# Altium project Tutorial.PrjPcb
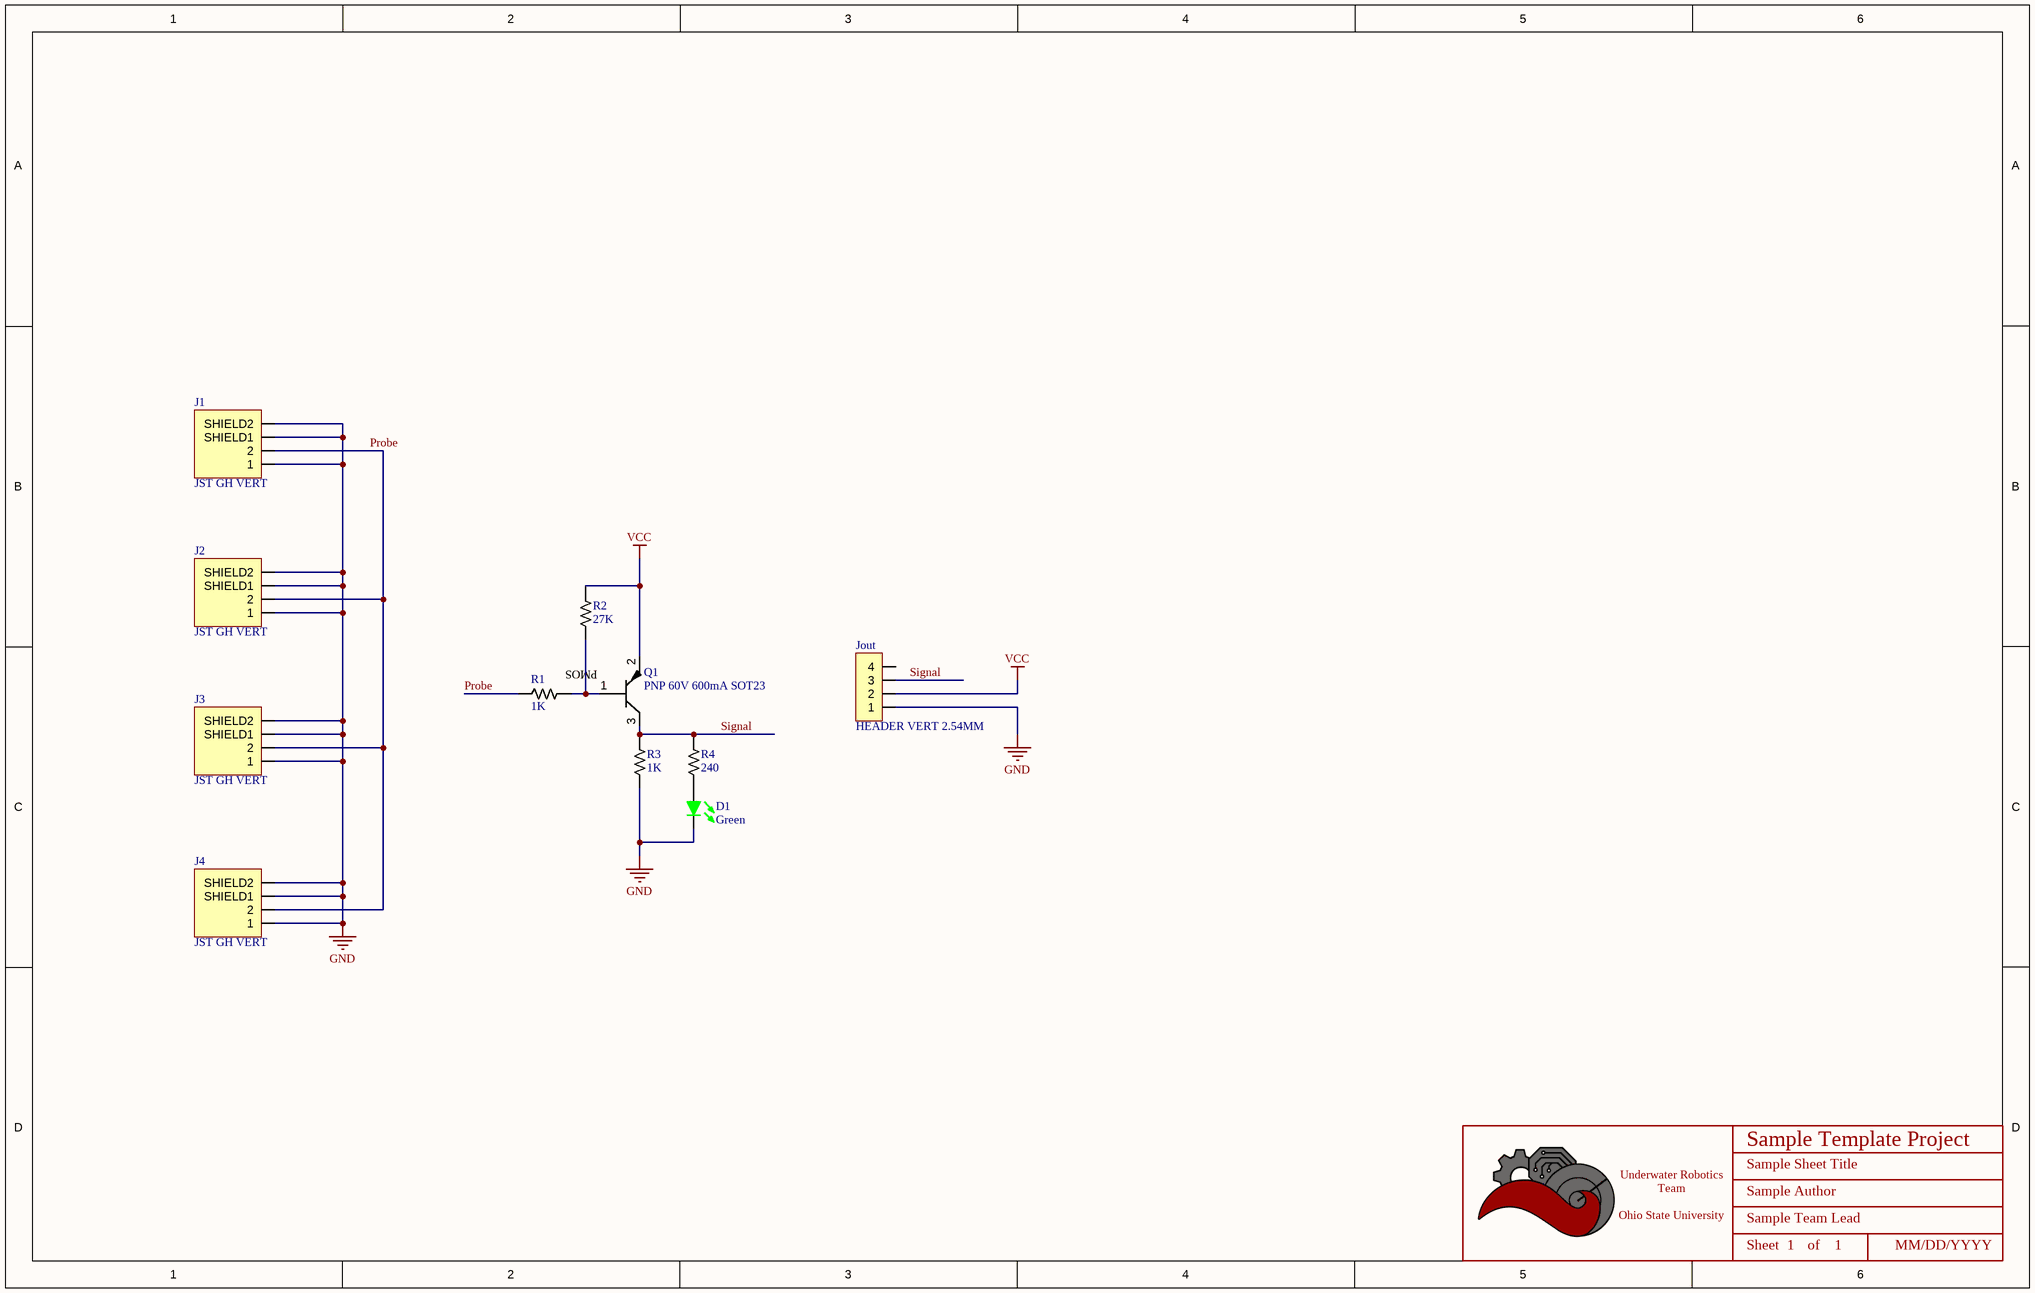
[diagram p0: Water Intrustion.SchDoc]
BoardRevision: 1.0; DateOfDesignReview: XX/XX/XXXX; ProjectTitle: Sample Template Project; TeamLead: Sample Team Lead
1 sheet, 12 parts. Net scope: global (net labels, ports and power ports of the same name join across sheets).
Board file: Water Intrusion.PcbDoc

## Sheet Water Intrustion.SchDoc: Sample Sheet Title
size B; Date: MM/DD/YYYY; Author: Sample Author; Organization: ORGANIZATION; Address1: ADDRESS 1; Address2: ADDRESS 2; Address3: ADDRESS 3; Address4: ADDRESS 4; Revision: -; SheetNumber: 1; SheetTotal: 1; ENG_APP_DATE: --/--/--; DSN_APP_DATE: --/--/--; CHK_APP_DATE: --/--/--

### Parts
*  Title_Block  [LOGO]  (value not drawn)  (graphical)
D1  Color: Green  [LED_0603]  (hidden comment: IN-S63AT5G)
J1  JST GH VERT  [CONN_JST_SM02B-GHS-TB(LF)(SN)]
J2  JST GH VERT  [CONN_JST_SM02B-GHS-TB(LF)(SN)]
J3  JST GH VERT  [CONN_JST_SM02B-GHS-TB(LF)(SN)]
J4  JST GH VERT  [CONN_JST_SM02B-GHS-TB(LF)(SN)]
Jout  HEADER VERT 2.54MM  [HEADER_4PIN_2.54MM]
Q1  PNP 60V 600mA SOT23  [SOT-23-3]
R1  Value  (Ohms): 1K  [RESISTOR_0603]  (hidden comment: 1k Ohm 5% 1/8W)
R2  Value  (Ohms): 27K  [RESISTOR_0603]  (hidden comment: 27k Ohm 5% 1/8W)
R3  Value  (Ohms): 1K  [RESISTOR_0603]  (hidden comment: 1k Ohm 5% 1/8W)
R4  Value  (Ohms): 240  [RESISTOR_0603]  (hidden comment: RES SMD 240 OHM 5% 1/10W 0603)

### Nets
GND: D1.2 J1.1 J1.S1(SHIELD1) J1.S2(SHIELD2) J2.1 J2.S1(SHIELD1) J2.S2(SHIELD2) J3.1 J3.S1(SHIELD1) J3.S2(SHIELD2) J4.1 J4.S1(SHIELD1) J4.S2(SHIELD2) Jout.1 R3.2
VCC: Jout.2 Q1.2 R2.1
Probe: J1.2 J2.2 J3.2 J4.2 R1.2
Signal: Jout.3 Q1.3 R3.1 R4.1
NetD1_1: D1.1 R4.2
NetQ1_1: Q1.1 R1.1 R2.2

Not connected (* = marked no-connect by the designer): Jout 4

### Notes on the sheet
- DWG. NO.
- REV.
- SHT.
- THIS DOCUMENT AND THE DATA DISCLOSED HEREIN OR HEREWITH IS THE PROPERTY OF ALTIUM LIMITED AND MAY BE FREELY DISTRIBUTED IN WHOLE. NO RIGHTS ARE RESERVED OR EXPRESS OR IMPLIED WARANTEE GIVEN.
- REVISION
- DESCRIPTION
- DATE
- APPROVED
- ENG:
- APPROVALS
- PROJECT
- DSN:
- CHK:
- REFERENCE DOCUMENTS
- PROJECT REVISION:
- TITLE
- DOCUMENT REVISION:
- DESIGN ITEM:
- BOM:
- FAB DWG:
- PCB DWG:
- ASSY DWG:
- SCALE:
- SIZE
- B
- CAGE CODE
- FILE NAME
- DWG NO.
- SHEET
- OF
- REV
- (in symbol MMBT2907A-7-F) PMOS
- (in symbol Title_Block) Underwater Robotics Team / Ohio State University; Sheet; of

### Library data of the parts
* = Title_Block: UWRT Schematic Title Block Template / Created June 2021, Dylan Trainor
D1 = LED_Green_0603_3V: LED Green Vf= 3V If = 0.005A / IN-S63AT5G; Made By: Robert Pafford; Forward Current: 5mA; ComponentLink1Description: Datasheet; ComponentLink1URL: https://www.we-online.de/katalog/datasheet/150060GS75000.pdf; Forward Voltage: 3V; Package: 0603; Supplier 1: Digi-Key; Supplier Part Number 1: 1830-1062-1-ND
J1-J4 = CONN_JST_GH_2POS_VERT: JST GH Pitch 2 Pos Vertical; Pitch: 1.25mm; Current Per Pin: 1A; Number of Positions: 4; Manufacturer: JST; Configuration: Vertical; Color: Natural; Created By: Robert P; Series: GH; Supplier 1: Digi-Key; Supplier Part Number 1: 455-1564-1-ND
Jout = HEADER_4PIN_2.54MM: CONN HEADER VERT 4POS 2.54MM; Made By: Robert Pafford; Supplier 1: Digi-Key; Supplier Part Number 1: S1012E-04-ND
Q1 = MMBT2907A-7-F: PNP 60 V 600mA Surface Mount SOT-23; Vendor: Digikey; Vgs (Max): ±10V; Vgs (th): 800mV @ 250µA; Vdss: 20 V; Power Dissipation: 1.56W (Tc); Rds (on): 50mOhm @ 3A, 4.5V; Amp Rating: 600mA; BJT Type: PNP; Package: TO-236-3, SC-59, SOT-23-3; Manufacturer_Part_Number: MMBT2907A-7-F; Created By: Robert Pafford; ComponentLink1Description: Datasheet; ComponentLink1URL: https://media.digikey.com/pdf/Data%20Sheets/Diodes%20PDFs/MMBT2907A_Rev2016.pdf; Supplier 1: Digi-Key; Supplier Part Number 1: MMBT2907A-FDICT-ND
R1 R3 = RESISTOR_1K_0603: RES 1k OHM 5% 1/8W 0603; Tolerance: +/- 5%; Made By: Robert Pafford; ComponentLink1Description: Datasheet; ComponentLink1URL: https://www.bourns.com/docs/product-datasheets/CRxxxxx.pdf; Wattage: 1/8W; Supplier: Digikey; Digikey Part Numer: CR0603-JW-104ELFTR-ND; Supplier 1: Digi-Key; Supplier Part Number 1: 2019-RK73B1JTTD102JCT-ND
R2 = RESISTOR_27K_0603_1: RES SMD 27K OHM 5% 1/10W 0603; Tolerance: +/- 5%; Made By: John Ulm; ComponentLink1Description: Datasheet; ComponentLink1URL: https://www.bourns.com/docs/product-datasheets/CRxxxxx.pdf; Wattage: 1/10W; Supplier: Digikey; Digikey Part Numer: ERJ-3GEYJ273V; Supplier 1: Digikey; Supplier Part Number 1: P27KGCT-ND
R4 = RESISTOR_240_0603: Tolerance: +/- 5%; Made By: John Ulm; ComponentLink1Description: Datasheet; ComponentLink1URL: https://www.bourns.com/docs/product-datasheets/CRxxxxx.pdf; Wattage: 1/10W; Supplier: Digikey; Digikey Part Numer: ERJ-3GEYJ241V; Supplier 1: Digikey; Supplier Part Number 1: P240GCT-ND